# Altium schematic sheet 51shiyanban.SchDoc
size B
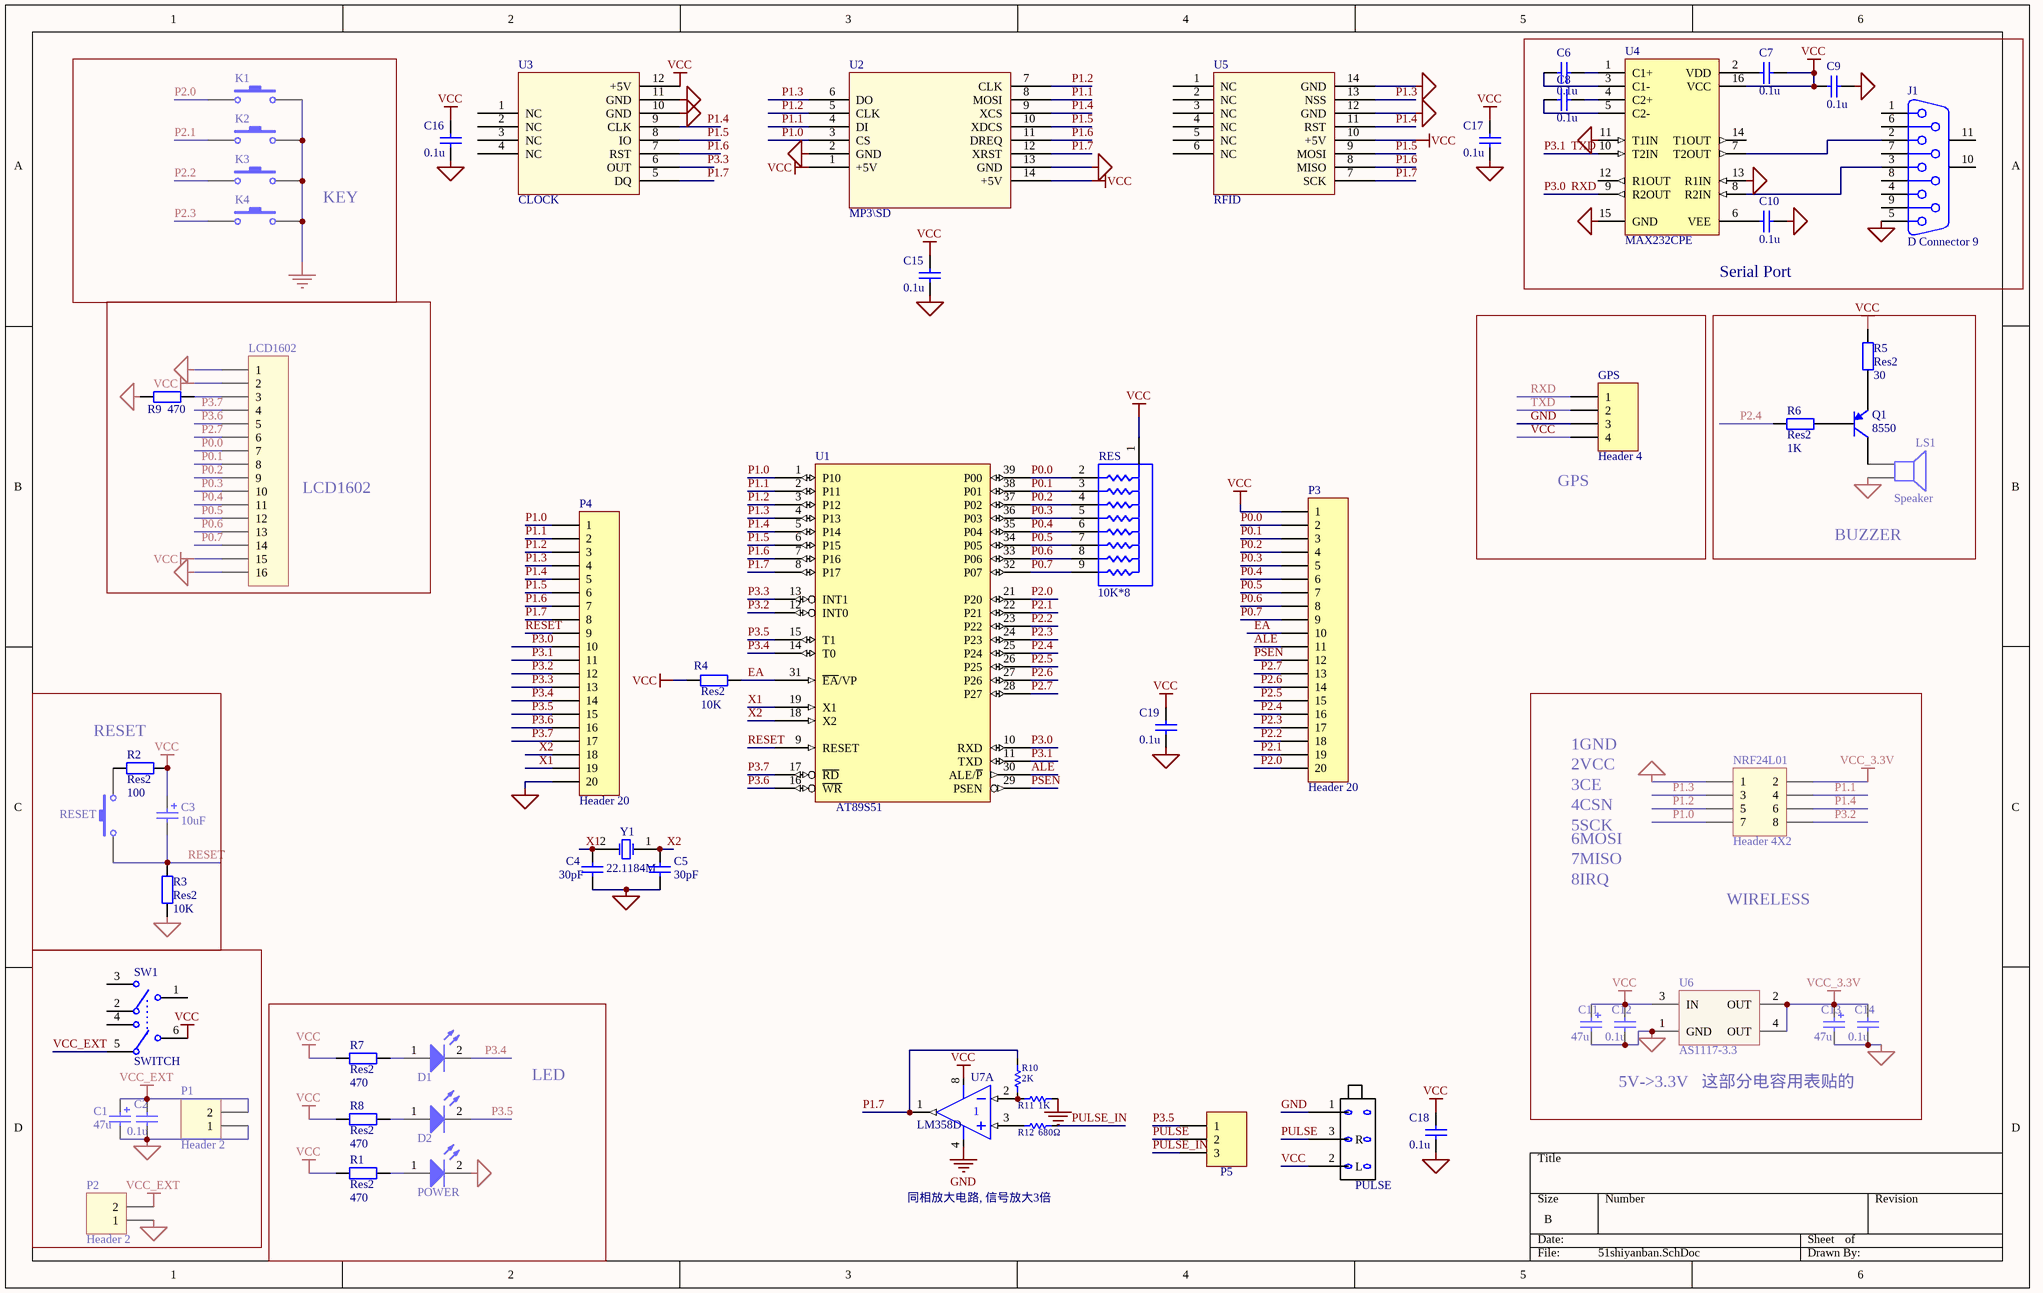
[diagram p0: 51shiyanban.SchDoc]

## Parts
C1  value 47u  [CAP3_HT]  (hidden comment: Cap Pol1)
C2  value 0.1u  [CAP1_HT]
C3  value 10uF  [CAP3_HT]  (hidden comment: Cap Pol1)
C4  value 30pF  [CAP1_HT]  (hidden comment: 30P)
C5  value 30pF  [CAP1_HT]  (hidden comment: 30P)
C6  0.1u  [CAP1_HT]
C7  0.1u  [CAP1_HT]
C8  0.1u  [CAP1_HT]
C9  0.1u  [CAP1_HT]
C10  0.1u  [CAP1_HT]
C11  value 47u  [CAP_CA_D]
C12  0.1u  [C0805]
C13  value 47u  [CAP_CA_D]
C14  0.1u  [C0805]
C15  0.1u  [C0805]
C16  0.1u  [C0805]
C17  0.1u  [C0805]
C18  0.1u  [C0805]
C19  0.1u  [C0805]
D1  LED0  [LED1_HT]  (value not drawn)
D2  LED0  [LED1_HT]  (value not drawn)
GPS  Header 4  [HDR1X4]
J1  D Connector 9  [DSUB1.385-2H9]
K1  (no value)  [KEY1_HT]
K2  (no value)  [KEY1_HT]
K3  (no value)  [KEY1_HT]
K4  (no value)  [KEY1_HT]
LCD1602  Header 16  [HDR1X16]  (value not drawn)
LS1  Speaker  [BUZZER_HT]
NRF24L01  Header 4X2  [HDR2X4]
P1  Header 2  [DCJACK]
P2  Header 2  [Power_small]
P3  Header 20  [HDR1X20]
P4  Header 20  [HDR1X20]
P5  Header 3  [HDR1X3]  (value not drawn)
POWER  LED0  [LED1_HT]  (value not drawn)
PULSE  Phonejack  [3.5mmphonejack]  (value not drawn)
Q1  8550  [Transistor]
R1  Res2  value 470  [AXIAL-0.4]
R2  Res2  value 100  [AXIAL-0.4]
R3  Res2  value 10K  [AXIAL-0.4]
R4  Res2  value 10K  [AXIAL-0.4]
R5  Res2  value 30  [AXIAL-0.4]
R6  Res2  value 1K  [AXIAL-0.4]
R7  Res2  value 470  [AXIAL-0.4]
R8  Res2  value 470  [AXIAL-0.4]
R9  value 470  [AXIAL-0.4]  (hidden comment: Res2)
R10  2K  [C0805]
R11  1K  [C0805]
R12  680Ω  [C0805]
RES  10K*8  [RES3_HT]
RESET  (no value)  [KEY1_HT]
SW1  SWITCH  [DPDT-6]
U1  AT89S51  [KDIP40_HT]
U2  MP3\SD  [MP3SD]
U3  CLOCK  [CLOCK]
U4  MAX232CPE  [DIP-16]
U5  RFID  [RFID]
U6  AS1117-3.3  [SOT-223]
U7  LM358D  [751-02_N]  (part A of 2)
Y1  22.1184M  [XTAL1_HT]

## Blocks framed on the sheet
KEY: K1-K4
Serial Port: C6-C10 J1 U4
LCD1602: LCD1602 R9
GPS: GPS
BUZZER: LS1 Q1 R5 R6
RESET: C3 R2 R3 RESET
LED: D1 D2 POWER R1 R7 R8

## Nets
GND: C1.2 C2.2 C4.2 C5.2 C9.2 C10.2 C11.2 C12.2 C13.2 C14.2 C15.2 C16.2 C17.2 C18.2 C19.2 GPS.3 J1.5 K1.2 K2.2 K3.2 K4.2 LCD1602.1 LCD1602.16 LS1.2 NRF24L01.1 P1.1 P2.1 P4.20 POWER.2(K) PULSE.1(GBUF) R3.1 R9.2 R11.2 U1.20(GND) U2.2(GND) U2.13(GND) U3.10(GND) U3.11(GND) U4.11(T1IN) U4.13(R1IN) U4.15(GND) U5.12(GND) U5.14(GND) U6.1(GND) U7.4(V-)
VCC: C3.1 C7.2 C9.1 C11.1 C12.1 C15.1 C16.1 C17.1 C18.1 C19.1 GPS.4 LCD1602.2 LCD1602.15 P3.1 PULSE.2(L) R1.1 R2.1 R4.2 R5.1 R7.1 R8.1 RES.1 SW1.6 U1.40(VCC) U2.1(+5V) U2.14(+5V) U3.12(+5V) U4.16(VCC) U5.10(+5V) U6.3(IN) U7.8(V+)
VCC_3.3V: C13.1 C14.1 NRF24L01.2 U6.2(OUT) U6.4(OUT)
VCC_EXT: C1.1 C2.1 P1.2 P2.2 SW1.5
ALE: P3.11 U1.30(ALE/~{P})
EA: P3.10 R4.1 U1.31(~{EA}/VP)
P0.0: LCD1602.7 P3.2 RES.2 U1.39(P00)
P0.1: LCD1602.8 P3.3 RES.3 U1.38(P01)
P0.2: LCD1602.9 P3.4 RES.4 U1.37(P02)
P0.3: LCD1602.10 P3.5 RES.5 U1.36(P03)
P0.4: LCD1602.11 P3.6 RES.6 U1.35(P04)
P0.5: LCD1602.12 P3.7 RES.7 U1.34(P05)
P0.6: LCD1602.13 P3.8 RES.8 U1.33(P06)
P0.7: LCD1602.14 P3.9 RES.9 U1.32(P07)
P1.0: NRF24L01.7 P4.1 U1.1(P10) U2.3(CS)
P1.1: NRF24L01.4 P4.2 U1.2(P11) U2.4(DI) U2.8(MOSI)
P1.2: NRF24L01.5 P4.3 U1.3(P12) U2.5(CLK) U2.7(CLK)
P1.3: NRF24L01.3 P4.4 U1.4(P13) U2.6(DO) U5.13(NSS)
P1.4: NRF24L01.6 P4.5 U1.5(P14) U2.9(XCS) U3.9(CLK) U5.11(RST)
P1.5: P4.6 U1.6(P15) U2.10(XDCS) U3.8(IO) U5.9(MOSI)
P1.6: P4.7 U1.7(P16) U2.11(DREQ) U3.7(RST) U5.8(MISO)
P1.7: P4.8 R10.2 U1.8(P17) U2.12(XRST) U3.5(DQ) U5.7(SCK) U7.1(OUT)
P2.0: K1.1 P3.20 U1.21(P20)
P2.1: K2.1 P3.19 U1.22(P21)
P2.2: K3.1 P3.18 U1.23(P22)
P2.3: K4.1 P3.17 U1.24(P23)
P2.4: P3.16 R6.2 U1.25(P24)
P2.5: P3.15 U1.26(P25)
P2.6: P3.14 U1.27(P26)
P2.7: LCD1602.6 P3.13 U1.28(P27)
P3.0: GPS.1 P4.10 U1.10(RXD) U4.9(R2OUT)  [also labelled RXD]
P3.1: GPS.2 P4.11 U1.11(TXD) U4.10(T2IN)  [also labelled TXD]
P3.2: NRF24L01.8 P4.12 U1.12(INT0)
P3.3: P4.13 U1.13(INT1) U3.6(OUT)
P3.4: D1.2(K) P4.14 U1.14(T0)
P3.5: D2.2(K) P4.15 P5.1 U1.15(T1)
P3.6: LCD1602.5 P4.16 U1.16(~{WR})
P3.7: LCD1602.4 P4.17 U1.17(~{RD})
PSEN: P3.12 U1.29(PSEN)
PULSE: P5.2 PULSE.3(R)
PULSE_IN: P5.3 R12.2
RESET: C3.2 P4.9 R3.2 RESET.1 U1.9(RESET)
X1: C4.1 P4.19 U1.19(X1) Y1.2(OSC2)
X2: C5.1 P4.18 U1.18(X2) Y1.1(OSC1)
NetC6_1: C6.1 U4.3(C1-)
NetC6_2: C6.2 U4.1(C1+)
NetC7_1: C7.1 U4.2(VDD)
NetC8_1: C8.1 U4.5(C2-)
NetC8_2: C8.2 U4.4(C2+)
NetC10_1: C10.1 U4.6(VEE)
NetD1_1: D1.1(A) R7.2
NetD2_1: D2.1(A) R8.2
NetJ1_2: J1.2 U4.7(T2OUT)
NetJ1_3: J1.3 U4.8(R2IN)
NetLCD1602_3: LCD1602.3 R9.1
NetLS1_1: LS1.1 Q1.3(C)
NetPOWER_1: POWER.1(A) R1.2
NetQ1_1: Q1.1(E) R5.2
NetQ1_2: Q1.2(B) R6.1
NetR2_2: R2.2 RESET.2
NetR10_1: R10.1 R11.1 U7.2(IN-)
NetR12_1: R12.1 U7.3(IN+)

Not connected (* = marked no-connect by the designer): J1 1 4 6 7 8 9 10(MH1) 11(MH2); SW1 1 2 3 4; U3 1(NC) 2(NC) 3(NC) 4(NC); U4 12(R1OUT) 14(T1OUT); U5 1(NC) 2(NC) 3(NC) 4(NC) 5(NC) 6(NC)

## Notes on the sheet
- 1GND
- 2VCC
- 3CE
- 4CSN
- 5SCK
- 6MOSI
- 7MISO
- 8IRQ
- WIRELESS
- 5V->3.3V   这部分电容用表贴的
- 同相放大电路, 信号放大3倍

## Library data of the parts
C1 C3 C11 C13 = Cap Pol1: Polarized Capacitor (Radial); Manufacturer: Generic Components; Class: Passive; Published: 08/06/2000; Publisher: Altium Hobart Technology Centre; SubClass: Capacitor
C2 C4-C10 C12 C14-C19 = Cap: Capacitor; Manufacturer: Generic Components; Class: Passive; Published: 08/06/2000; Publisher: Altium Hobart Technology Centre; SubClass: Capacitor
  C6-C10 C12 C14-C19: Value: 0.1u
D1 D2 POWER = LED0: Typical INFRARED GaAs LED; Manufacturer: Generic Components; Class: Optoelectronic; Published: 08/06/2000; Publisher: Altium Hobart Technology Centre; SubClass: LED
GPS = Header 4: Header, 4-Pin; LatestRevisionDate: 17-Jul-2002; LatestRevisionNote: Re-released for DXP Platform.; Publisher: Altium Limited
J1 = D Connector 9: Receptacle Assembly, 9 Position, Right Angle; PackageDocument: O; Positions: 9; Published: 15-Jun-2001; LatestRevisionDate: 17-Jul-2002; LatestRevisionNote: Re-released for DXP Platform.; DatasheetDocument: 1-Sep-1999; PackageReference: 788750; Publisher: Altium Limited; Orientation: Right Angle; Gender: Receptacle
K1-K4 RESET = SW-PB: Switch; Manufacturer: Generic Components; Published: 1999
LCD1602 = Header 16: Header, 16-Pin; Revision: 17-Jul-2002: Re-released for DXP Platform.; Publisher: Altium Limited
LS1 = Speaker: Loudspeaker; Manufacturer: Generic Components; Published: 1999
NRF24L01 = Header 4X2: Header, 4-Pin, Dual row; LatestRevisionDate: 17-Jul-2002; LatestRevisionNote: Re-released for DXP Platform.; Publisher: Altium Limited
P1 P2 = Header 2: Header, 2-Pin; Manufacturer: Generic Components; Class: Connector
P3 P4 = Header 20: Header, 20-Pin; LatestRevisionDate: 17-Jul-2002; LatestRevisionNote: Re-released for DXP Platform.; Publisher: Altium Limited
P5 = Header 3: Header, 3-Pin; LatestRevisionDate: 17-Jul-2002; LatestRevisionNote: Re-released for DXP Platform.; Publisher: Altium Limited
Q1 = 2N3906: PNP General Purpose Amplifier; Published: 8-Jun-2000; LatestRevisionDate: 15-Jan-2003; LatestRevisionNote: PCB Footprint 'BCY-W3/D4.7' replaced; DatasheetDocument: 1997; PackageDocument: Sep-1998; PackageReference: TO-92A; Publisher: Altium Limited; Code_JEDEC: TO-92A; ComponentLink1Description: Manufacturer Link; ComponentLink1URL: http://www.fairchildsemi.com/; ComponentLink2Description: Datasheet; ComponentLink2URL: http://www.fairchildsemi.com/ds/2N%2F2N3906.pdf
R1-R9 = Res2: Resistor; Published: 8-Jun-2000; LatestRevisionDate: 17-Jul-2002; LatestRevisionNote: Re-released for DXP Platform.; PackageReference: AXIAL-0.4; Publisher: Altium Limited
R10-R12 = Res1: Resistor; Published: 8-Jun-2000; Revision: July-2002: Re-released for DXP Platform.; Publisher: Altium Limited
  R10: Value: 2K
  R11: Value: 1K
  R12: Value: 680Ω
RES = RESPACK
SW1 = SW-DPDT
U1 = 8031
U2 = MP3SD
U4 = MAX232CPE: +5V Powered RS-232 Driver/Receiver; Published: 16-Jan-2001; LatestRevisionDate: 06-Jun-2005; LatestRevisionNote: Stylized 3D Model Added.; DatasheetVersion: Apr-1992; PackageVersion: 1997; PackageReference: PE16A; Publisher: Altium Limited; PackageDescription: DIP; 16 Leads; Row Spacing 7.62 mm; Pitch 2.54 mm; Code_JEDEC: MS-001-BB; ComponentLink1Description: Manufacturer Link; ComponentLink1URL: http://www.maxim-ic.com/; ComponentLink2Description: Datasheet; ComponentLink2URL: http://pdfserv.maxim-ic.com/en/ds/MAX220-MAX249.pdf
U7 = LM358D: Dual Low-Power Operational Amplifier; Published: 17-Jul-2002; LatestRevisionDate: 13-Apr-2006; LatestRevisionNote: IPC-7351 Footprint Added.; DatasheetVersion: 1988; PackageReference: 751-02; Publisher: Altium Limited; PackageDescription: 8-Pin Small Outline Integrated Circuit 1.27 mm Pitch; Code_JEDEC: MS-012-AA; Code_IPC: SOIC127P600-8; ComponentLink1Description: Manufacturer Link; ComponentLink1URL: http://www.onsemi.com/site/products/parametrics/0,4446,251,00.html; ComponentLink2Description: Datasheet; ComponentLink2URL: http://www.onsemi.com/pub/Collateral/LM358-D.PDF
Y1 = XTAL: Crystal Oscillator; Manufacturer: Generic Components; Published: 08/06/2000; Publisher: Altium Hobart Technology Centre; Class: Oscillator; SubClass: Crystal Oscillator